# EasyEDA Pro project ProDoc_ControlPad.epro

# Board ControlPad_PCB
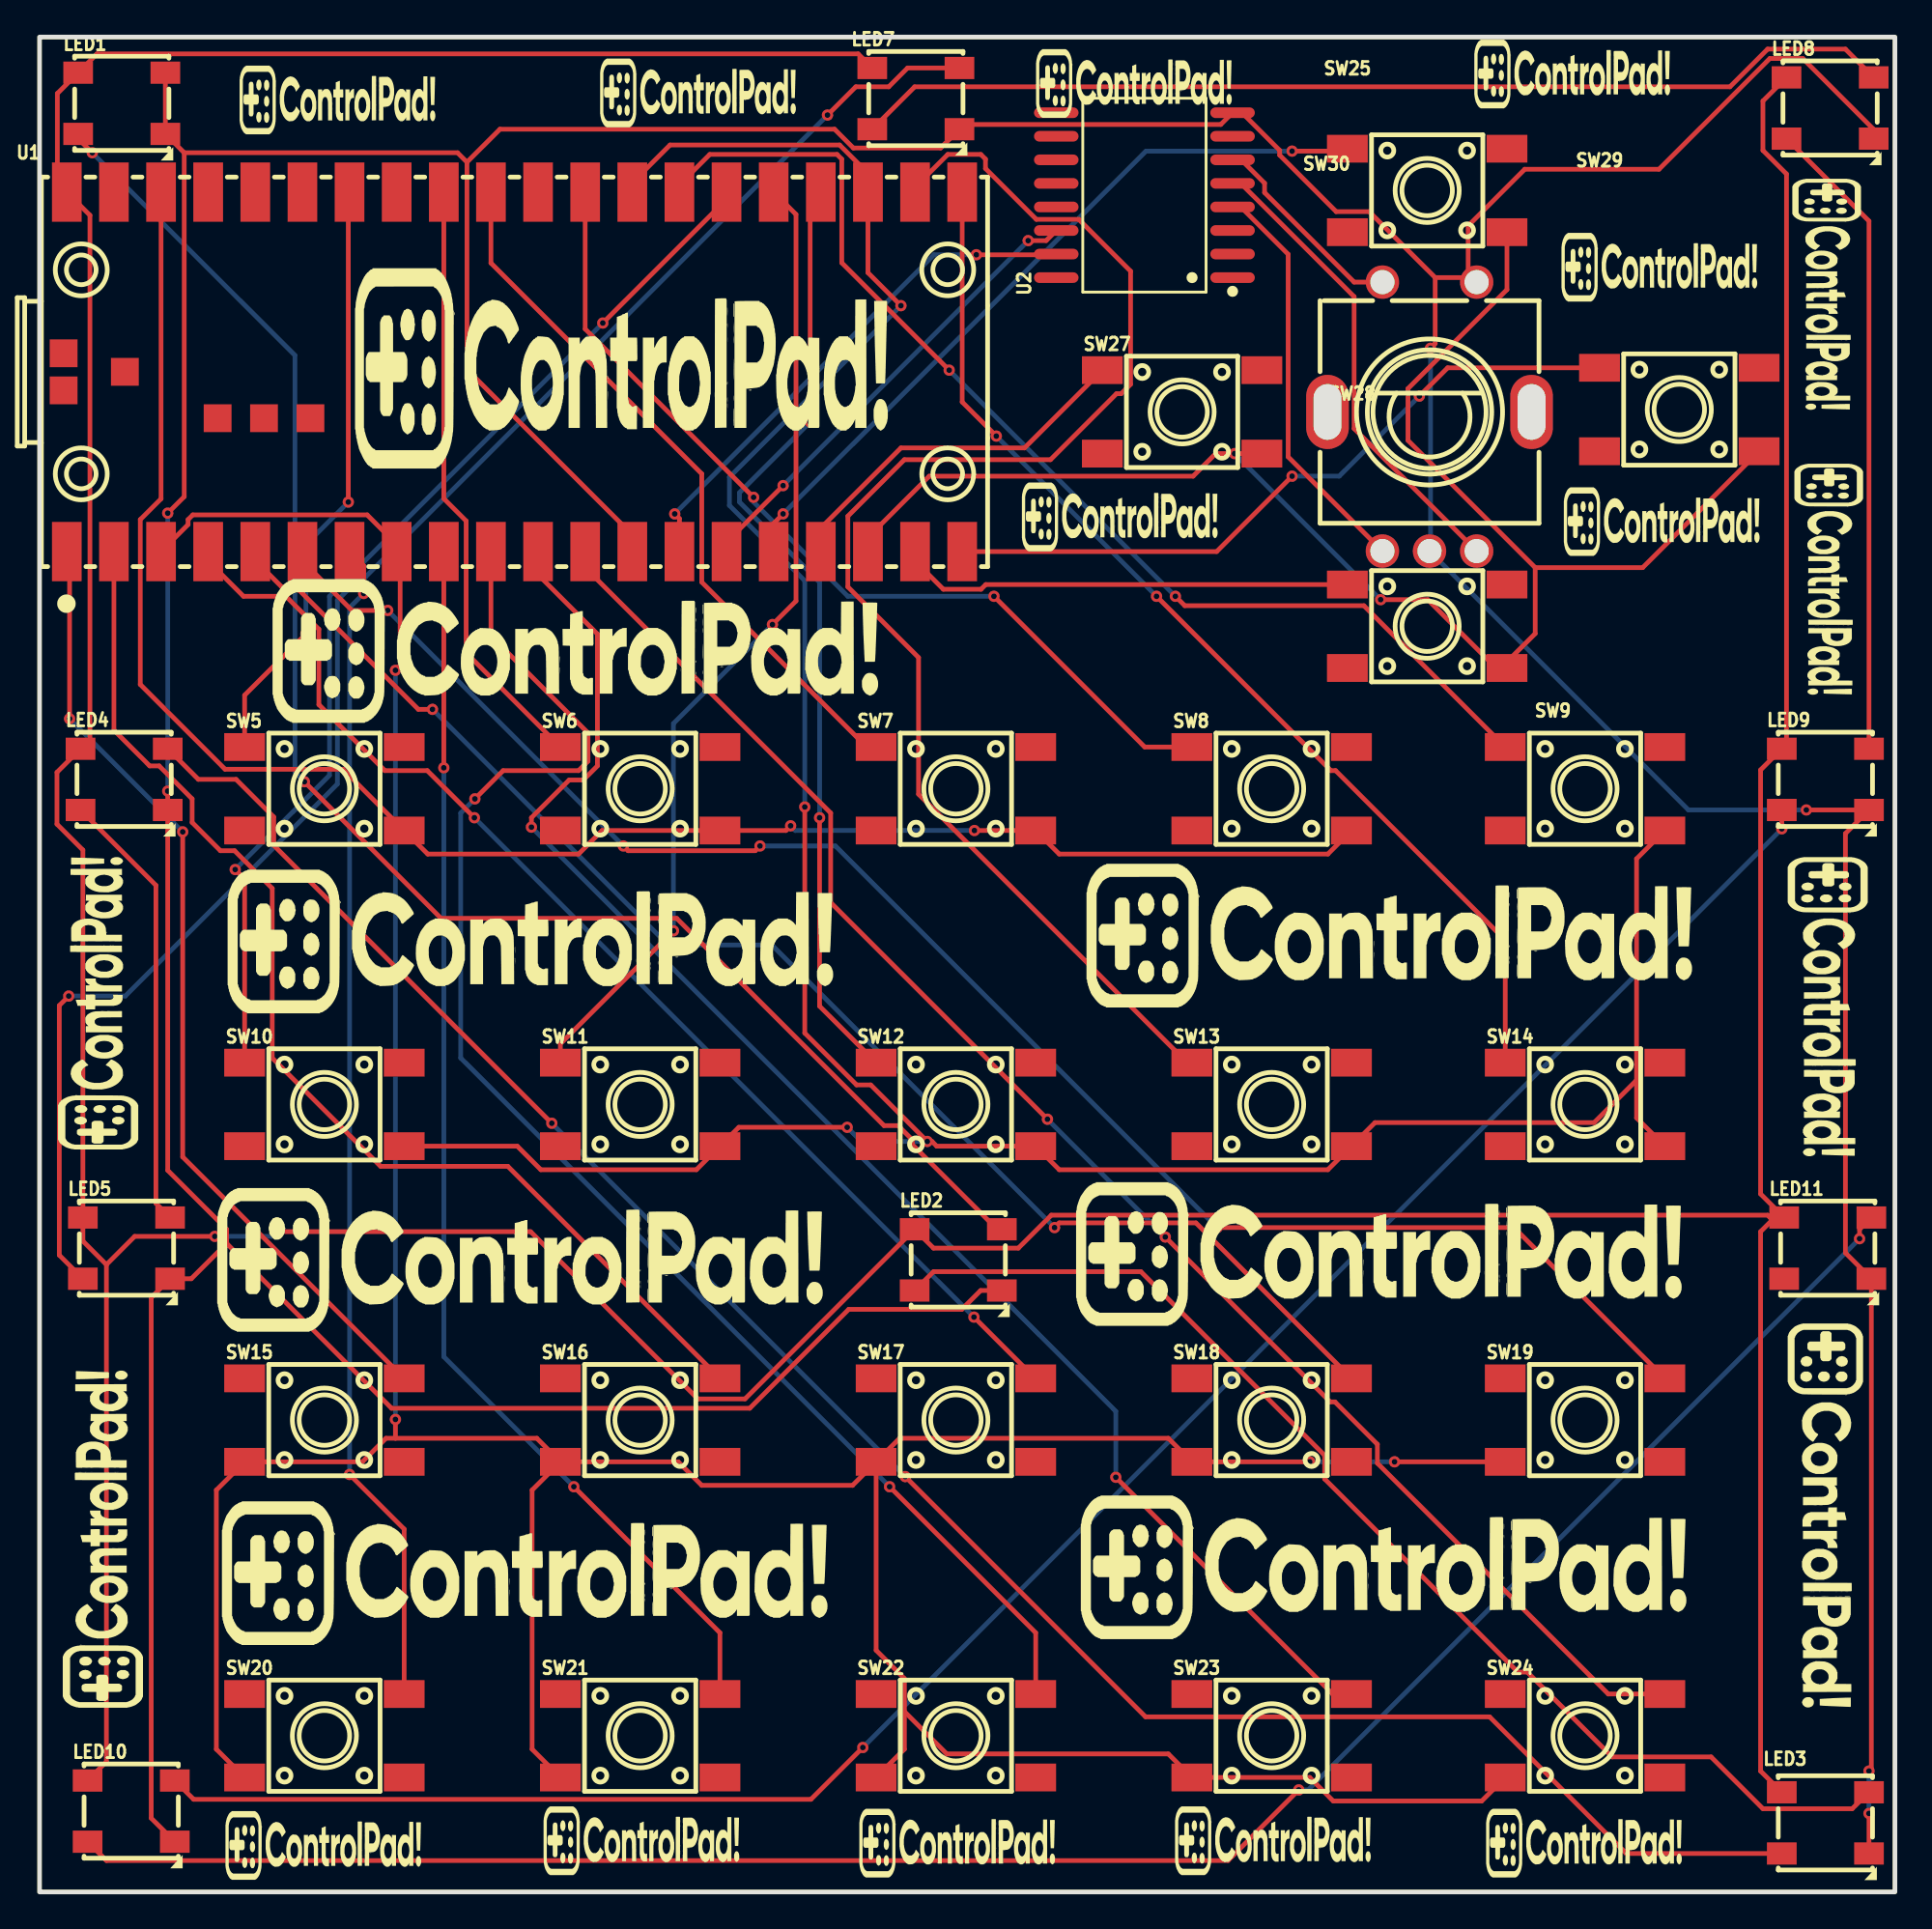
[diagram p0: board, top side]
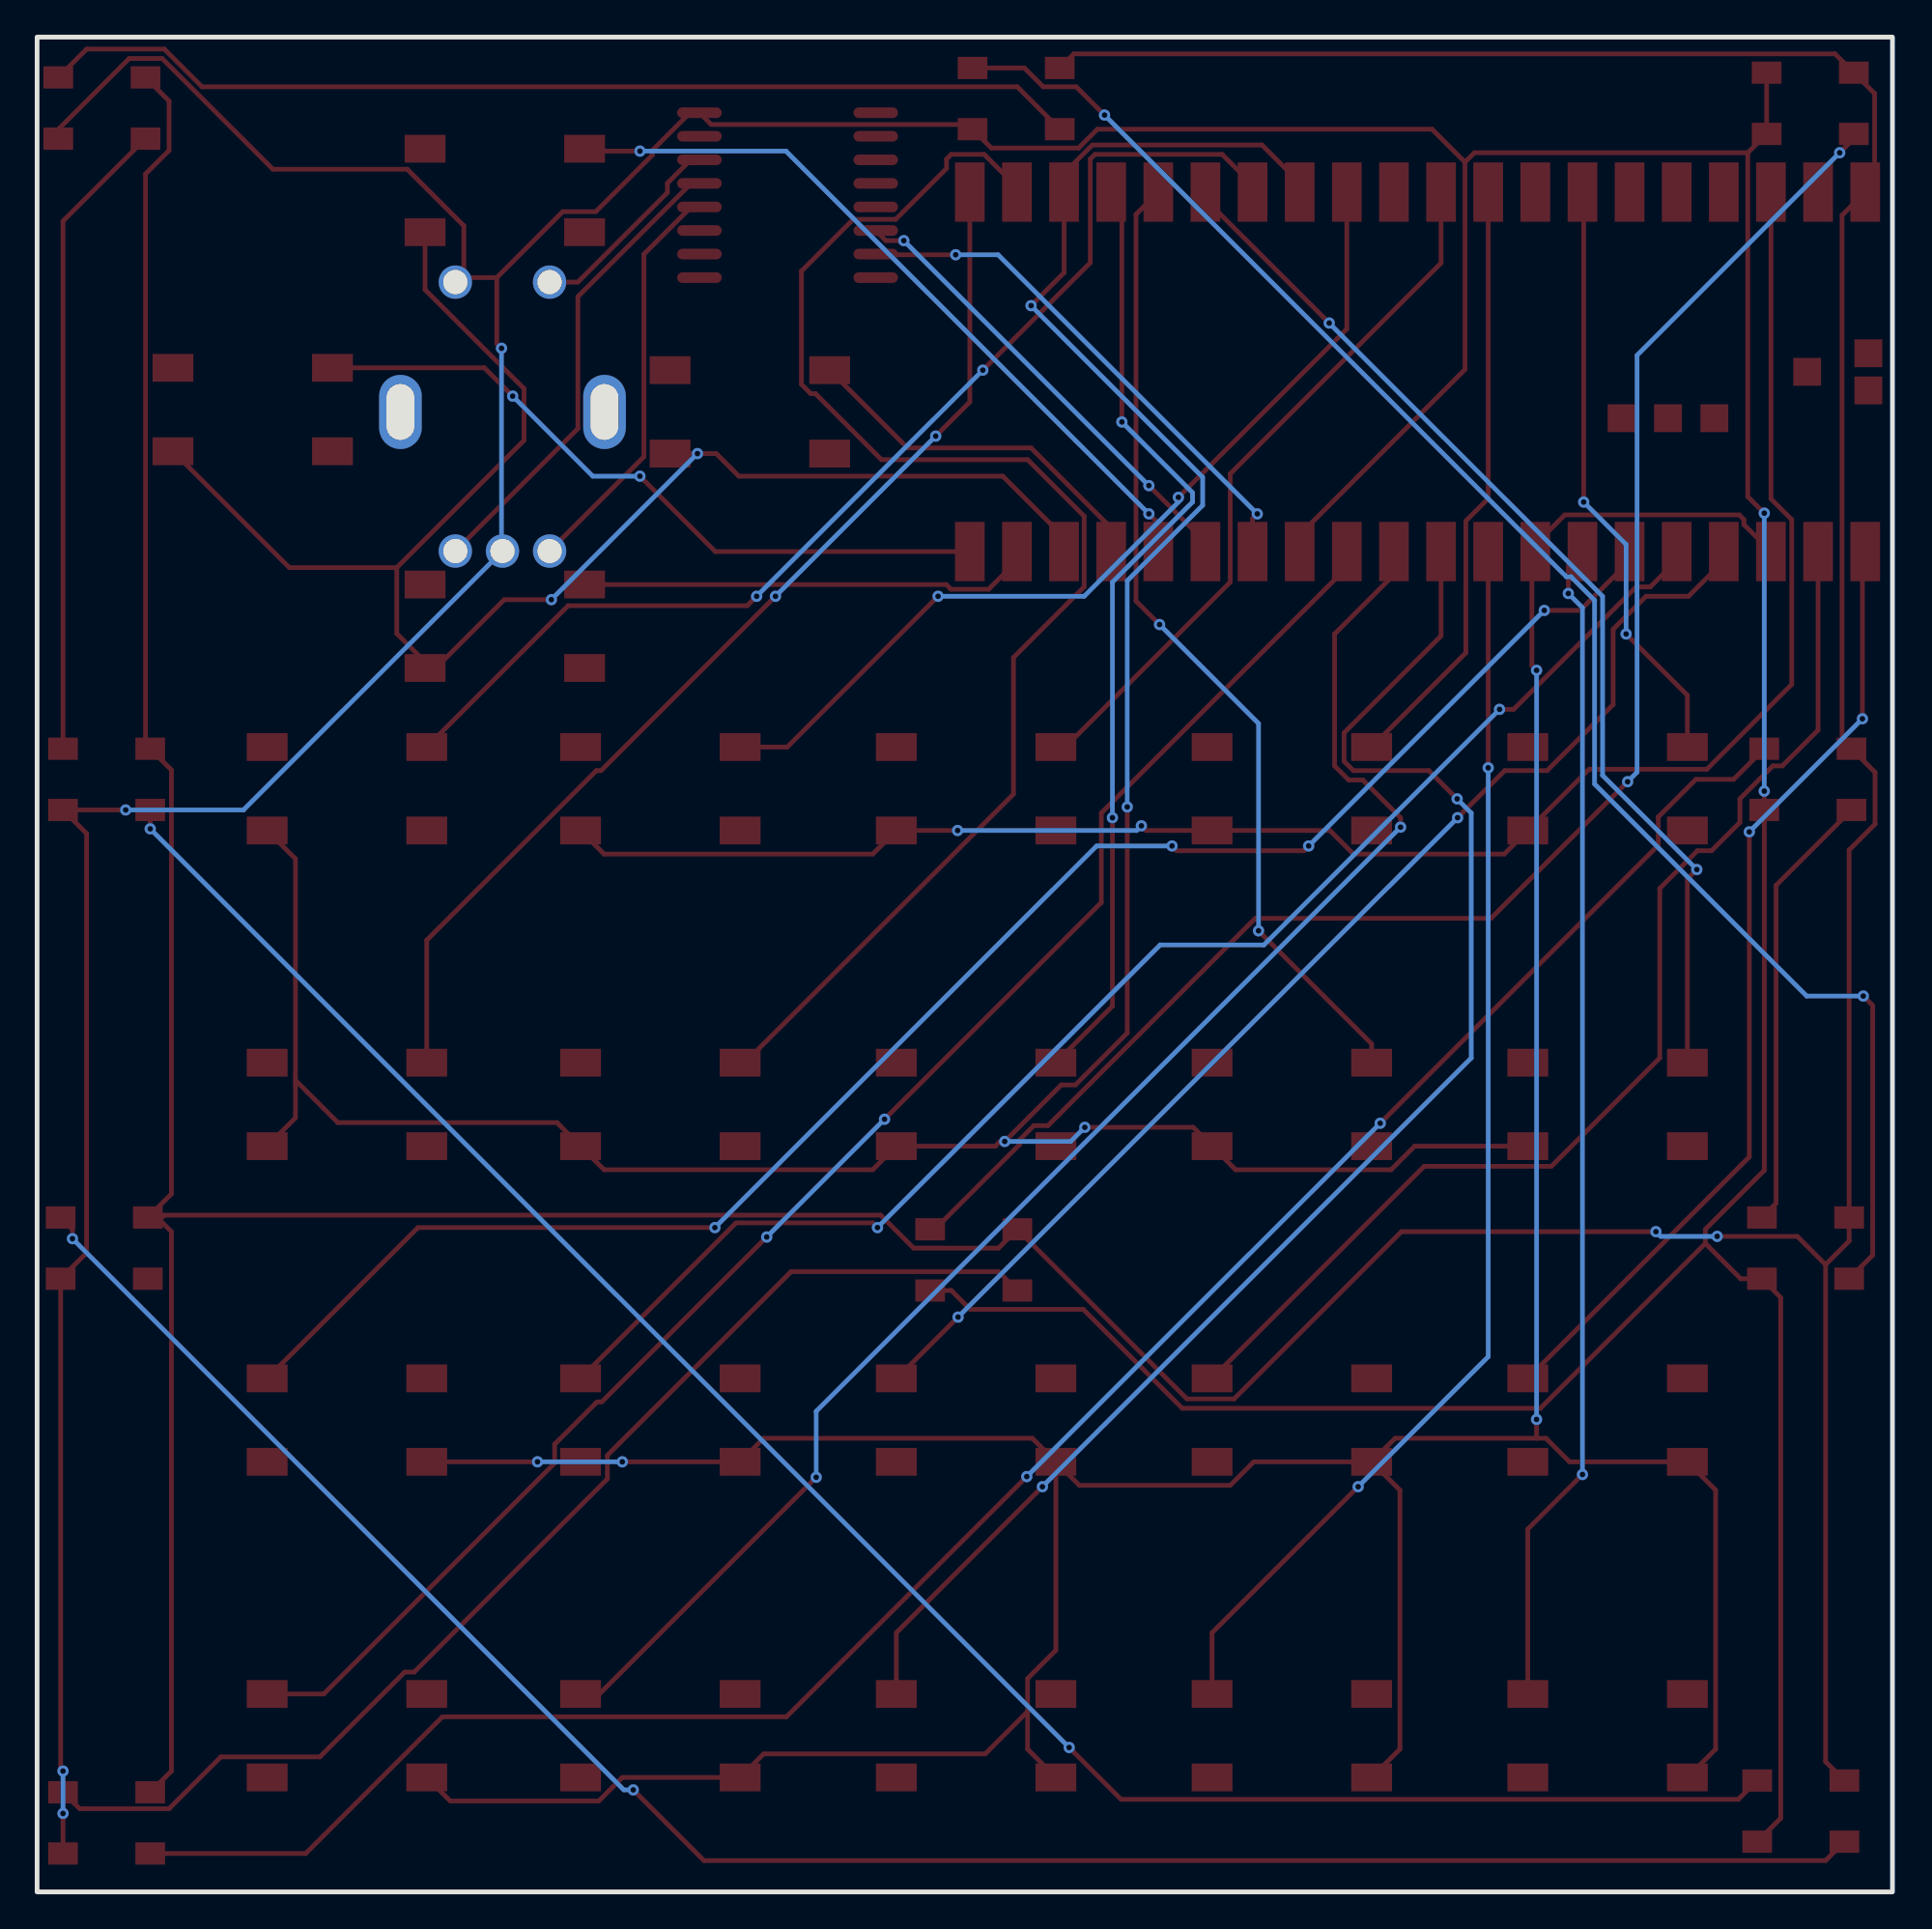
[diagram p1: board, bottom side, seen from below]

Outline 100 x 100 mm; copper layers: Top Layer, Bottom Layer. Coordinates in mm from the lower left corner of the outline.
Outline path: rectangle 0,100 100,0
Stack: Top Layer 0.035mm / Dielectric1 1.51mm FR4 er 4.5 / Bottom Layer 0.035mm

## Design rules (mm)
template: JLCPCB Capability(Two Layers Board)
spacing copperThickness1oz (default): track to track 0.102, other pairs 0.152 to 0.3
spacing copperThickness2oz: track to track 0.203, other pairs 0.152 to 0.3
track width copperThickness1oz (default): min 0.127, default 0.254, max 2.54
track width copperThickness2oz: min 0.203, default 0.254, max 2.54
differential pair differentialPair (default): width min 0.127, default 0.254, max 2.54; gap min 0.152, default 0.152
via viaSize (default): diameter min 0.5, default 0.61, max 10; hole min 0.3, default 0.305, max 6.3

## Placement (name value [footprint] x y rotation side)
LED1  WS2812B-V5  [LED-SMD_4P-L5.0-W5.0-LS5.4-TL-1]  4.43 96.43 0 top
LED2  WS2812B-V5  [LED-SMD_4P-L5.0-W5.0-LS5.4-TL-1]  49.52 34.07 0 top
LED3  WS2812B-V5  [LED-SMD_4P-L5.0-W5.0-LS5.4-TL-1]  96.25 3.72 0 top
LED4  WS2812B-V5  [LED-SMD_4P-L5.0-W5.0-LS5.4-TL-1]  4.56 59.98 0 top
LED5  WS2812B-V5  [LED-SMD_4P-L5.0-W5.0-LS5.4-TL-1]  4.69 34.71 0 top
LED7  WS2812B-V5  [LED-SMD_4P-L5.0-W5.0-LS5.4-TL-1]  47.23 96.69 0 top
LED8  WS2812B-V5  [LED-SMD_4P-L5.0-W5.0-LS5.4-TL-1]  96.51 96.18 0 top
LED9  WS2812B-V5  [LED-SMD_4P-L5.0-W5.0-LS5.4-TL-1]  96.25 59.98 0 top
LED10  WS2812B-V5  [LED-SMD_4P-L5.0-W5.0-LS5.4-TL-1]  4.94 4.36 0 top
LED11  WS2812B-V5  [LED-SMD_4P-L5.0-W5.0-LS5.4-TL-1]  96.38 34.71 0 top
SW5  TS-1102S-C-C-B  [KEY-SMD_4P-L6.0-W6.0-P4.50-LS8.6]  15.35 59.47 0 top
SW6  TS-1102S-C-C-B  [KEY-SMD_4P-L6.0-W6.0-P4.50-LS8.6]  32.37 59.47 0 top
SW7  TS-1102S-C-C-B  [KEY-SMD_4P-L6.0-W6.0-P4.50-LS8.6]  49.39 59.47 0 top
SW8  TS-1102S-C-C-B  [KEY-SMD_4P-L6.0-W6.0-P4.50-LS8.6]  66.41 59.47 0 top
SW9  TS-1102S-C-C-B  [KEY-SMD_4P-L6.0-W6.0-P4.50-LS8.6]  83.3 59.47 0 top
SW10  TS-1102S-C-C-B  [KEY-SMD_4P-L6.0-W6.0-P4.50-LS8.6]  15.35 42.46 0 top
SW11  TS-1102S-C-C-B  [KEY-SMD_4P-L6.0-W6.0-P4.50-LS8.6]  32.37 42.46 0 top
SW12  TS-1102S-C-C-B  [KEY-SMD_4P-L6.0-W6.0-P4.50-LS8.6]  49.39 42.46 0 top
SW13  TS-1102S-C-C-B  [KEY-SMD_4P-L6.0-W6.0-P4.50-LS8.6]  66.41 42.46 0 top
SW14  TS-1102S-C-C-B  [KEY-SMD_4P-L6.0-W6.0-P4.50-LS8.6]  83.3 42.46 0 top
SW15  TS-1102S-C-C-B  [KEY-SMD_4P-L6.0-W6.0-P4.50-LS8.6]  15.35 25.44 0 top
SW16  TS-1102S-C-C-B  [KEY-SMD_4P-L6.0-W6.0-P4.50-LS8.6]  32.37 25.44 0 top
SW17  TS-1102S-C-C-B  [KEY-SMD_4P-L6.0-W6.0-P4.50-LS8.6]  49.39 25.44 0 top
SW18  TS-1102S-C-C-B  [KEY-SMD_4P-L6.0-W6.0-P4.50-LS8.6]  66.41 25.44 0 top
SW19  TS-1102S-C-C-B  [KEY-SMD_4P-L6.0-W6.0-P4.50-LS8.6]  83.3 25.44 0 top
SW20  TS-1102S-C-C-B  [KEY-SMD_4P-L6.0-W6.0-P4.50-LS8.6]  15.35 8.42 0 top
SW21  TS-1102S-C-C-B  [KEY-SMD_4P-L6.0-W6.0-P4.50-LS8.6]  32.37 8.42 0 top
SW22  TS-1102S-C-C-B  [KEY-SMD_4P-L6.0-W6.0-P4.50-LS8.6]  49.39 8.42 0 top
SW23  TS-1102S-C-C-B  [KEY-SMD_4P-L6.0-W6.0-P4.50-LS8.6]  66.41 8.42 0 top
SW24  TS-1102S-C-C-B  [KEY-SMD_4P-L6.0-W6.0-P4.50-LS8.6]  83.3 8.42 0 top
SW25  TS-1102S-C-C-B  [KEY-SMD_4P-L6.0-W6.0-P4.50-LS8.6]  74.79 91.73 0 top
SW27  TS-1102S-C-C-B  [KEY-SMD_4P-L6.0-W6.0-P4.50-LS8.6]  61.58 79.79 0 top
SW28  TS-1102S-C-C-B  [KEY-SMD_4P-L6.0-W6.0-P4.50-LS8.6]  74.79 68.24 0 top
SW29  TS-1102S-C-C-B  [KEY-SMD_4P-L6.0-W6.0-P4.50-LS8.6]  88.38 79.92 0 top
SW30  EC11E15244G1  [SW-TH_EC11E15244G1]  74.92 79.54 0 top
U1  PICO W  [COMM-SMD_L51.0-W21.0-P2.54_PICOW]  25.51 81.95 0 top
U2  PCF8574T/3,518  [SOIC-16_L10.3-W7.5-P1.27-LS10.3-BL]  59.55 91.48 90 top

## Footprints (pads in the part's own frame, mm; a bottom-side part is the same pattern mirrored in y, then rotated)
COMM-SMD_L51.0-W21.0-P2.54_PICOW
  rect 1.6x3.2 smd: 1(-24.045,-9.69) 2(-21.505,-9.69) 3(-18.965,-9.69) 4(-16.425,-9.69) 5(-13.885,-9.69) 6(-11.345,-9.69) 7(-8.805,-9.69) 8(-6.265,-9.69) 9(-3.725,-9.69) 10(-1.185,-9.69) 11(1.355,-9.69) 12(3.895,-9.69) 13(6.435,-9.69) 14(8.975,-9.69) 15(11.515,-9.69) 16(14.055,-9.69) 17(16.595,-9.69) 18(19.135,-9.69) 19(21.675,-9.69) 20(24.215,-9.69) 21(24.215,9.69) 22(21.675,9.69) 23(19.135,9.69) 24(16.595,9.69) 25(14.055,9.69) 26(11.515,9.69) 27(8.975,9.69) 28(6.435,9.69) 29(3.895,9.69) 30(1.355,9.69) 31(-1.185,9.69) 32(-3.725,9.69) 33(-6.265,9.69) 34(-8.805,9.69) 35(-11.345,9.69) 36(-13.885,9.69) 37(-16.425,9.69) 38(-18.965,9.69) 39(-21.505,9.69) 40(-24.045,9.69)
  rect 1.5x1.5 smd: TP1(-20.915,0) TP2(-24.215,1) TP3(-24.215,-1) TP4(-15.915,-2.499) TP5(-13.415,-2.499) TP6(-10.915,-2.499)
KEY-SMD_4P-L6.0-W6.0-P4.50-LS8.6
  rect 2.2x1.5 smd: 1(-4.3,2.25) 2(4.3,2.25) 3(-4.3,-2.25) 4(4.3,-2.25)
LED-SMD_4P-L5.0-W5.0-LS5.4-TL-1
  rect 1.6x1.2 smd: 1(-2.35,1.65) 2(-2.35,-1.65) 3(2.35,-1.65) 4(2.35,1.65)
SOIC-16_L10.3-W7.5-P1.27-LS10.3-BL
  oval 0.574x2.401 smd: 1(-4.445,-4.75) 2(-3.175,-4.75) 3(-1.905,-4.75) 4(-0.635,-4.75) 5(0.635,-4.75) 6(1.905,-4.75) 7(3.175,-4.75) 8(4.445,-4.75) 9(4.445,4.75) 10(3.175,4.75) 11(1.905,4.75) 12(0.635,4.75) 13(-0.635,4.75) 14(-1.905,4.75) 15(-3.175,4.75) 16(-4.445,4.75)
SW-TH_EC11E15244G1
  oval 2.3x4 hole 1.5x3: 6(5.5,0.25) 7(-5.5,0.25)
  round 1.8 hole 1.3: A(-2.54,-7.25) B(2.54,-7.25) C(0,-7.25) D(-2.54,7.25) E(2.54,7.25)

## Nets
$1N2245: SW5.1 U1.34
$1N2299: SW6.1 U1.32
$1N2360: SW7.1 U1.31
$1N2422: SW8.1 U1.29
$1N2609: SW11.1 U1.25
$1N2668: SW12.1 U1.24
$1N2773: SW13.1 U1.22
$1N2780: SW14.1 U1.21
$1N3743: SW15.2 U1.1
$1N3782: SW16.2 U1.2
$1N3788: SW15.3 SW16.3 SW17.3 SW18.3 SW19.3 SW20.3 SW21.3 SW22.3 SW23.3 SW24.3 U1.3 U1.8
$1N3846: SW17.2 U1.4
$1N3905: SW18.2 U1.5
$1N3977: SW19.2 U1.6
$1N3989: SW20.2 U1.7
$1N4282: SW21.2 U1.9
$1N4289: SW22.2 U1.10
$1N4296: SW23.2 U1.11
$1N4309: SW24.2 U1.12
$1N4488: SW9.1 U1.27
$1N4493: SW10.1 U1.26
$1N4521: SW9.4 SW10.4 SW11.4 SW12.4 SW13.4 SW14.4 U1.23 U1.28
$1N4534: SW5.4 SW6.4 SW7.4 SW8.4 U1.38
$1N6719: LED1.2 LED2.4
$1N6761: LED1.1 LED2.1 LED3.1 LED4.1 LED5.1 LED7.1 LED8.1 LED9.1 LED10.1 LED11.1 U1.40
$1N6769: LED1.3 LED1.4 LED2.3 LED3.3 LED4.3 LED5.3 LED7.3 LED8.3 LED9.3 LED10.3 LED11.3 SW30.C SW30.E U1.13 U2.8
$1N6820: LED2.2 LED3.4
$1N6984: LED3.2 LED4.4
$1N6992: LED4.2 LED5.4
$1N7089: LED5.2 LED7.4
$1N7321: LED7.2 LED8.4
$1N7347: LED8.2 LED9.4
$1N7353: LED9.2 LED10.4
$1N7359: LED10.2 LED11.4
$1N8537: SW25.1 U1.16
$1N8543: SW27.1 U1.17
$1N8567: SW28.1 U1.19
$1N8570: SW29.1 U1.20
$1N8743: SW25.4 SW27.4 SW28.4 SW29.4 U1.18
$1N8774: U1.14 U2.15
$1N8781: U1.15 U2.14
$1N9248: SW30.A U2.4
$1N9331: SW30.D U2.6
$1N9337: SW30.B U2.5

Pads without a net: LED11 2; SW5 2 3; SW6 2 3; SW7 2 3; SW8 2 3; SW9 2 3; SW10 2 3; SW11 2 3; SW12 2 3; SW13 2 3; SW14 2 3; SW15 1 4; SW16 1 4; SW17 1 4; SW18 1 4; SW19 1 4; SW20 1 4; SW21 1 4; SW22 1 4; SW23 1 4; SW24 1 4; SW25 2 3; SW27 2 3; SW28 2 3; SW29 2 3; SW30 6 7; U1 30 33 35 36 37 39 TP1 TP2 TP3 TP4 TP5 TP6; U2 1 2 3 7 9 10 11 12 13 16

## Via types
v1: diameter 0.61, hole 0.305, Top Layer to Bottom Layer, 72 vias

## Routing (per net, layer and track width the routed paths; a pad name or vN(x,y) marks a point on that pad's centre or on a via; arc(x,y) is an arc through that point)
$1N2245: length 32.3
  Top Layer w0.254: SW5.1 11.05,64.52 v1(14.36,67.82) ; v1(16.64,74.93) 16.64,91.58 16.71,91.64
  Bottom Layer w0.254: v1(16.64,74.93) 14.36,72.65 v1(14.36,67.82)
$1N2299: length 32.5
  Top Layer w0.254: SW6.1 22.99,66.8 22.99,73.92 21.79,75.12 21.79,91.64
$1N2360: length 38.8
  Top Layer w0.254: 24.33,91.64 24.33,87.82 35.69,76.46 35.69,70.61 44.58,61.72 SW7.1
$1N2422: length 49.6
  Top Layer w0.254: 29.41,91.64 29.41,84.26 v1(38.49,75.19) ; SW8.1 59.57,61.72 v1(51.44,69.85)
  Bottom Layer w0.254: v1(38.49,75.19) 38.49,74.93 43.57,69.85 v1(51.44,69.85)
$1N2609: length 52.7
  Top Layer w0.254: 39.57,91.64 40.77,90.44 40.77,69.6 v1(39.5,68.33) ; v1(34.17,51.82) 28.07,45.72 SW11.1
  Bottom Layer w0.254: v1(34.17,51.82) 34.17,62.99 v1(39.5,68.33)
$1N2668: length 51.8
  Top Layer w0.254: v1(42.04,57.91) 42.04,47.75 SW12.1 ; 42.11,91.64 41.53,91.07 v1(41.53,79.25)
  Bottom Layer w0.254: v1(42.04,57.91) 42.04,70.61 37.72,74.93 37.72,75.44 v1(41.53,79.25)
$1N2773: length 77.1
  Top Layer w0.254: 47.19,91.64 47.43,91.88 47.43,92.15 48.95,93.68 50.73,93.68 50.99,93.42 50.99,92.91 53.73,90.17 56.01,90.17 58.81,87.38 58.81,81.28 58.3,80.77 58.04,80.77 54.49,77.22 46.61,77.22 43.57,74.17 43.57,70.36 47.38,66.55 47.38,59.18 61.85,44.71 SW13.1
$1N2780: length 59.2
  Top Layer w0.254: 49.73,91.64 49.73,80.33 v1(51.57,78.49) ; SW14.1 79,51.31 69.86,60.45 69.6,60.45 v1(60.2,69.85)
  Bottom Layer w0.254: v1(60.2,69.85) v1(51.57,78.49)
$1N3743: length 52.1
  Top Layer w0.254: v1(7.72,57.15) 7.72,39.63 SW15.2 ; U1.1 1.62,72.11 v1(1.62,63.25)
  Bottom Layer w0.254: v1(7.72,57.15) v1(1.62,63.25)
$1N3782: length 62.9
  Top Layer w0.254: U1.2 4.01,62.64 5.94,60.71 6.45,60.71 8.22,58.93 8.22,57.66 9.75,56.14 10.51,56.14 12.54,54.1 12.54,44.96 18.38,39.12 25.24,39.12 SW16.2
$1N3788: length 223.6
  Top Layer w0.254: SW20.3 9.53,7.69 9.53,21.66 SW15.3 17.4,23.19 18.67,24.46 19.18,24.46 ; 19.18,24.46 v1(19.18,25.47) ; 19.18,24.46 26.8,24.46 SW16.3 ; SW16.3 34.42,23.19 35.69,21.92 43.82,21.92 SW17.3 ; SW16.3 26.55,21.66 26.55,7.69 SW21.3 ; SW22.3 46.61,7.69 46.61,9.73 ; 46.61,9.73 48.9,7.44 60.84,7.44 SW23.3 68.46,6.17 69.73,4.9 77.73,4.9 SW24.3 ; 46.61,9.73 46.61,11.5 45.09,13.03 SW17.3 ; v1(68.46,23.19) SW18.3 60.84,24.46 46.36,24.46 SW17.3 ; 19.18,72.21 19.18,72.72 17.66,74.24 8.26,74.24 8.01,73.99 8.01,73.72 U1.3 ; 19.18,72.21 19.44,71.96 19.44,66.11 v1(19.18,65.86) ; 19.18,72.21 U1.8 ; v1(73.03,23.19) SW19.3
  Bottom Layer w0.254: v1(19.18,25.47) v1(19.18,65.86) ; v1(68.46,23.19) v1(73.03,23.19)
$1N3846: length 65.7
  Top Layer w0.254: v1(50.36,30.99) 53.66,27.69 53.69,27.69 ; v1(23.44,57.91) 20.9,60.45 18.61,60.45 15.06,64.01 15.06,68.07 13.28,69.85 10.99,69.85 9.09,71.76 U1.4
  Bottom Layer w0.254: v1(50.36,30.99) v1(23.44,57.91)
$1N3905: length 78
  Top Layer w0.254: U1.5 11.63,71.78 13.05,70.36 13.81,70.36 20.42,63.76 v1(21.18,63.76) ; v1(54.71,35.82) 54.96,36.07 62.33,36.07 SW18.2
  Bottom Layer w0.254: v1(21.18,63.76) 33.88,51.06 39.47,51.06 v1(54.71,35.82)
$1N3977: length 92.4
  Top Layer w0.254: v1(38.83,56.39) 38.58,56.14 31.72,56.14 v1(31.47,56.39) ; v1(18.77,69.09) 16.83,69.09 14.19,71.73 14.19,72.24 U1.6 ; v1(63.47,35.82) 79.47,35.82 SW19.2
  Bottom Layer w0.254: v1(31.47,56.39) v1(18.77,69.09) ; v1(38.83,56.39) 42.9,56.39 v1(63.47,35.82)
$1N3989: length 63.4
  Top Layer w0.254: SW20.2 19.65,19.56 v1(16.71,22.51) ; v1(17.47,70) 17.47,71.5 U1.7
  Bottom Layer w0.254: v1(17.47,70) 16.71,69.24 v1(16.71,22.51)
$1N4282: length 67.8
  Top Layer w0.254: v1(28.8,21.85) 36.67,13.97 SW21.2 ; v1(21.79,60.61) U1.9
  Bottom Layer w0.254: v1(28.8,21.85) 21.79,28.86 v1(21.79,60.61)
$1N4289: length 81.8
  Top Layer w0.254: 53.69,10.67 53.69,13.97 v1(45.82,21.85) ; U1.10 24.33,67.72 29.56,62.49 29.56,60.96 29.05,60.45 24.99,60.45 v1(23.46,58.93)
  Bottom Layer w0.254: v1(45.82,21.85) 22.7,44.96 22.7,58.17 v1(23.46,58.93)
$1N4296: length 83.7
  Top Layer w0.254: v1(58.01,22.35) 69.69,10.67 SW23.2 ; U1.11 26.87,71.02 30.07,67.82 30.07,60.71 29.31,59.95 28.54,59.95 26.51,57.91 v1(26.51,57.41)
  Bottom Layer w0.254: v1(58.01,22.35) 58.01,25.91 v1(26.51,57.41)
$1N4309: length 87.6
  Top Layer w0.254: v1(54.33,41.66) 42.64,53.34 42.64,58.17 29.41,71.4 U1.12 ; SW24.2 84.55,10.67 72.11,23.12 72.11,24.13 69.82,26.42 69.57,26.42 v1(60.68,35.31)
  Bottom Layer w0.254: v1(60.68,35.31) v1(54.33,41.66)
$1N4488: length 62.1
  Top Layer w0.254: 34.49,91.64 34.49,92.04 36.13,93.68 42.98,93.68 43.24,93.42 43.24,87.83 v1(49.03,82.04) ; SW9.1 71.38,69.34 61.73,69.34 v1(61.22,69.85)
  Bottom Layer w0.254: v1(61.22,69.85) v1(49.03,82.04)
$1N4493: length 58.1
  Top Layer w0.254: v1(30.36,84.58) 37.03,91.26 37.03,91.64 ; SW10.1 11.05,54.61 v1(10.55,55.12)
  Bottom Layer w0.254: v1(10.55,55.12) 15.63,60.2 15.63,69.85 v1(30.36,84.58)
$1N4521: length 165.4
  Top Layer w0.254: v1(41.24,58.49) 41.24,46.3 44.04,43.51 44.8,43.51 v1(47.85,40.46) 48.1,40.46 48.36,40.21 53.69,40.21 54.96,38.94 69.44,38.94 SW13.4 71.98,41.48 83.79,41.48 86.08,43.76 ; v1(43.53,41.22) 37.69,41.22 SW11.4 35.4,38.94 27.02,38.94 25.75,40.21 SW10.4 ; SW9.4 86.08,55.7 86.08,43.76 ; 86.08,43.76 86.08,41.73 SW14.4 ; v1(46.43,85.52) 44.65,87.3 44.65,92.66 43.13,94.18 33.98,94.18 31.95,92.15 31.95,91.64
  Bottom Layer w0.254: v1(41.24,58.49) 41.24,70.69 37.18,74.75 37.18,76.27 v1(46.43,85.52) ; v1(43.53,41.22) 44.29,40.46 v1(47.85,40.46)
$1N4534: length 97.9
  Top Layer w0.254: v1(50.39,57.22) 53.69,57.22 54.96,55.95 69.44,55.95 SW8.4 ; 6.55,91.64 6.55,75.11 5.43,73.99 5.43,65.1 10,60.53 16.35,60.53 SW5.4 20.92,55.95 29.05,55.95 30.32,57.22 SW6.4 40.23,57.22 v1(40.48,57.48)
  Bottom Layer w0.254: v1(40.48,57.48) 40.74,57.22 v1(50.39,57.22)
$1N6719: length 87.7
  Top Layer w0.254: LED2.4 51.61,35.72 47.04,40.3 47.04,40.55 46.28,41.31 45.52,41.31 34.34,52.49 21.64,52.49 v1(14.27,59.86) ; 2.08,94.78 2.08,94.53 v1(2.84,93.77)
  Bottom Layer w0.254: v1(2.84,93.77) 13.77,82.84 13.77,60.36 v1(14.27,59.86)
$1N6761: length 334.4
  Top Layer w0.254: 94.16,97.83 92.89,96.56 92.89,93.89 94.16,92.62 94.16,61.89 LED9.1 92.76,60.49 92.76,37.63 94.03,36.36 93.52,36.36 ; v1(12.75,35.6) 26.47,35.6 35.48,26.58 38.02,26.58 LED2.1 48.18,34.71 52.76,34.71 54.53,36.49 93.14,36.49 93.27,36.36 93.52,36.36 ; v1(9.45,35.34) 5.13,35.34 3.61,33.82 ; 93.52,36.36 92.76,35.6 92.76,6.51 LED3.1 ; 3.61,33.82 3.61,7.02 2.59,6.01 ; 3.61,33.82 2.34,35.09 LED5.1 2.34,56.17 0.94,57.57 0.94,60.36 LED4.1 2.72,62.14 2.72,90.4 0.96,92.15 0.96,96.96 3.1,99.1 44.12,99.1 LED7.1
  Bottom Layer w0.254: v1(12.75,35.6) 12.5,35.34 v1(9.45,35.34)
$1N6769: length 381.1
  Top Layer w0.254: v1(98.6,6.52) 98.73,6.64 98.73,33.06 97.33,34.46 97.33,57.06 LED9.3 v1(95.23,58.33) ; v1(74.97,83.22) 75.22,83.48 75.22,87.03 ; LED8.3 98.84,94.54 98.84,95.04 95.03,98.85 93.26,98.85 87.29,92.88 80.05,92.88 77,89.83 77,87.03 ; 10.08,34.96 18.97,26.07 38.28,26.07 43.61,31.41 49.71,31.41 50.72,32.42 LED2.3 ; 10.08,34.96 8.18,33.06 7.04,33.06 6.02,32.04 6.02,3.98 LED10.3 ; 10.08,34.96 10.08,35.73 6.91,38.9 LED4.3 v1(6.91,59.35) ; 7.8,93.77 7.8,75.22 v1(6.91,74.33) ; 7.8,93.77 22.53,93.77 23.04,93.26 ; 7.8,93.77 LED1.3 LED1.4 ; 77,87.03 75.22,87.03 ; 77,87.03 77.21,87.03 SW30.E ; 75.22,87.03 71.67,90.59 69.89,90.59 66.84,93.64 66.84,93.89 64.81,95.92 U2.8 63.67,95.29 49.84,95.29 LED7.3 48.57,94.02 43.87,94.02 42.85,95.04 24.82,95.04 23.04,93.26 ; v1(98.6,4.23) LED3.3 ; 23.04,93.26 23.04,82.08 31.93,73.19 31.93,72.28 U1.13
  Bottom Layer w0.254: v1(74.97,83.22) 74.97,72.34 SW30.C 88.88,58.33 v1(95.23,58.33) ; v1(98.6,6.52) v1(98.6,4.23) ; v1(6.91,74.33) v1(6.91,59.35)
$1N6820: length 65
  Top Layer w0.254: LED3.4 97.7,4.48 92.89,4.48 90.09,7.28 84.76,7.28 80.19,11.85 79.68,11.85 69.27,22.26 69.27,23.53 59.36,33.44 48.18,33.44 LED2.2
$1N6984: length 112.6
  Top Layer w0.254: LED4.4 8.56,59.98 10.59,59.98 12.62,57.95 12.62,56.43 v1(27.61,41.44) ; v1(46.66,22.39) 59.61,9.44 78.16,9.44 85.52,2.07 LED3.2
  Bottom Layer w0.254: v1(46.66,22.39) v1(27.61,41.44)
$1N6992: length 24
  Top Layer w0.254: 7.04,36.36 6.27,37.12 6.27,54.27 LED4.2
$1N7089: length 90.5
  Top Layer w0.254: LED7.4 46.78,98.34 45.77,97.32 43.99,97.32 v1(42.47,95.8) ; v1(1.57,48.3) 1.07,47.79 1.07,34.33 2.34,33.06
  Bottom Layer w0.254: v1(42.47,95.8) 17.58,70.91 17.32,70.91 16.05,69.64 16.05,59.73 4.62,48.3 v1(1.57,48.3)
$1N7321: length 56.4
  Top Layer w0.254: 98.86,97.83 97.33,99.35 93.14,99.35 91.11,97.32 47.17,97.32 LED7.2
$1N7347: length 34.7
  Top Layer w0.254: LED9.4 98.6,90.08 LED8.2
$1N7353: length 109.7
  Top Layer w0.254: LED9.2 v1(93.9,57.32) ; LED10.4 8.3,4.99 41.58,4.99 v1(44.37,7.79)
  Bottom Layer w0.254: v1(93.9,57.32) v1(44.37,7.79)
$1N7359: length 111.2
  Top Layer w0.254: LED11.4 98.09,35.72 v1(98.09,35.22) ; v1(67.87,5.5) 64.06,1.69 3.61,1.69 2.59,2.71
  Bottom Layer w0.254: v1(98.09,35.22) 68.38,5.5 v1(67.87,5.5)
$1N8537: length 40.8
  Top Layer w0.254: SW25.1 70.36,93.85 v1(67.51,93.85) ; U1.16 39.57,73.79 v1(40.08,74.3)
  Bottom Layer w0.254: v1(40.08,74.3) 59.64,93.85 v1(67.51,93.85)
$1N8543: length 20
  Top Layer w0.254: SW27.1 53.09,77.85 46.43,77.85 42.11,73.53 U1.17
$1N8567: length 24.5
  Top Layer w0.254: 70.49,70.49 51,70.49 50.75,70.23 48.71,70.23 47.19,71.76 U1.19
$1N8570: length 38.5
  Top Layer w0.254: U1.20 63.45,72.26 v1(67.51,76.33) ; SW29.1 75.89,82.17 v1(74.37,80.65)
  Bottom Layer w0.254: v1(74.37,80.65) 70.05,76.33 v1(67.51,76.33)
$1N8743: length 87.1
  Top Layer w0.254: 65.88,77.54 v1(64.41,77.54) 63.39,77.54 62.18,76.33 47.95,76.33 44.65,73.03 U1.18 ; 78.89,66.11 78.38,66.11 74.82,69.67 v1(72.28,69.67) ; 78.89,66.11 80.61,67.84 80.61,71.4 ; 78.89,66.11 79.09,65.99 ; 79.09,89.48 79.09,86.38 73.76,81.05 73.76,78.26 80.61,71.4 ; SW29.4 86.41,71.4 80.61,71.4
  Bottom Layer w0.254: v1(64.41,77.54) v1(72.28,69.67)
$1N8774: length 28.5
  Top Layer w0.254: U1.14 34.49,74.04 v1(34.24,74.3) ; U2.15 54.76,88.27 v1(50.49,88.27)
  Bottom Layer w0.254: v1(34.24,74.3) 48.21,88.27 v1(50.49,88.27)
$1N8781: length 25.2
  Top Layer w0.254: U2.14 54.25,89.03 v1(53.29,89.03) ; v1(40.08,75.82) 37.03,72.77 U1.15
  Bottom Layer w0.254: v1(40.08,75.82) v1(53.29,89.03)
$1N9248: length 22.2
  Top Layer w0.254: SW30.A 67.3,77.37 67.3,88.29 64.75,90.84 U2.4
$1N9331: length 11.1
  Top Layer w0.254: SW30.D 70.85,86.79 66.03,91.62 66.03,92.12 64.76,93.39 64.31,93.39 U2.6
$1N9337: length 25.5
  Top Layer w0.254: SW30.B 70.85,78.89 70.85,86.01 64.75,92.11 U2.5
